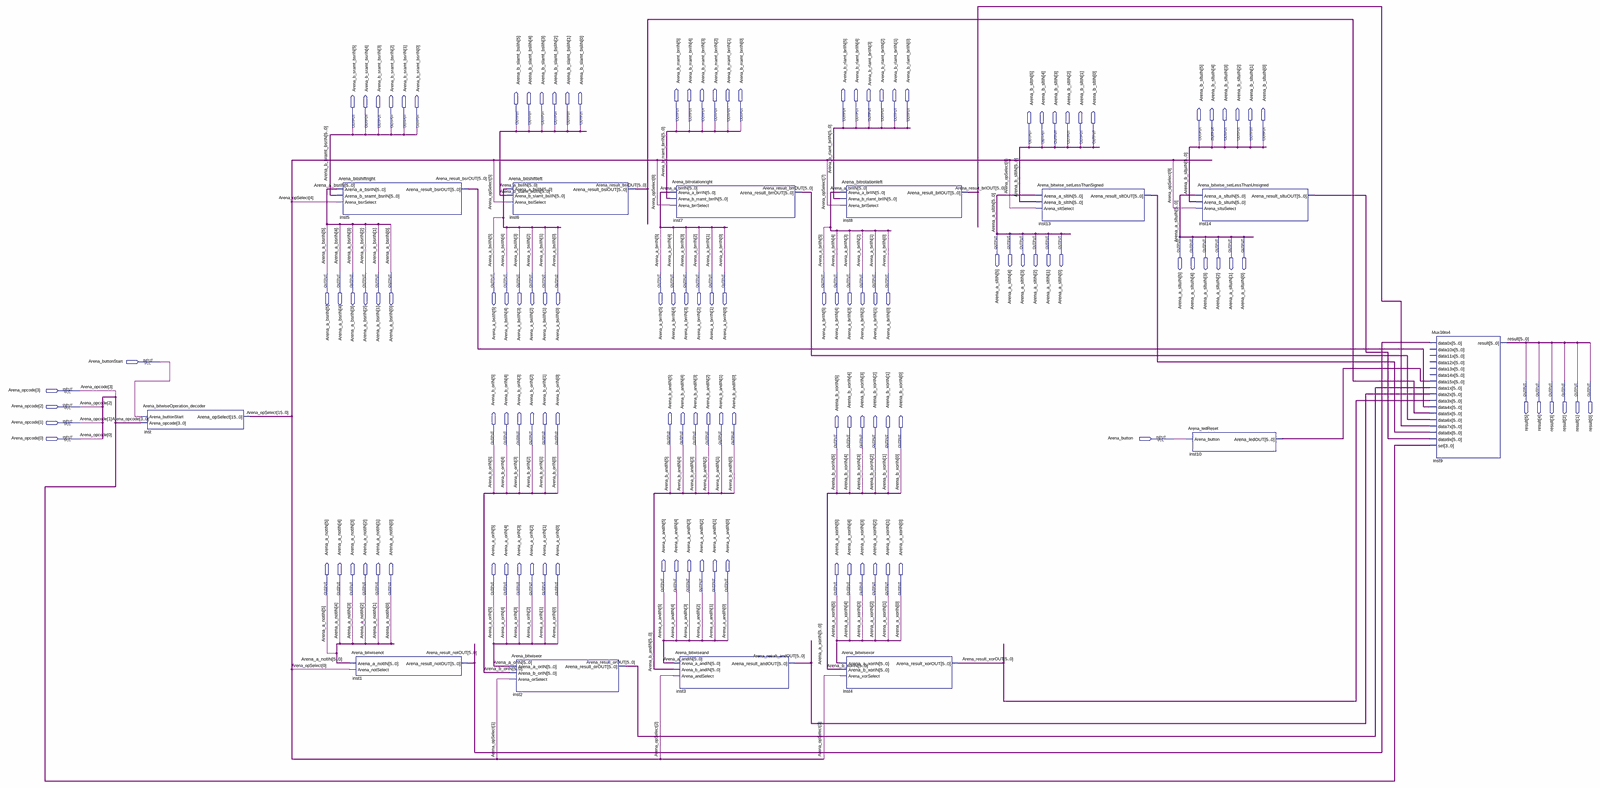
[diagram p0: schematic sheet, whole]
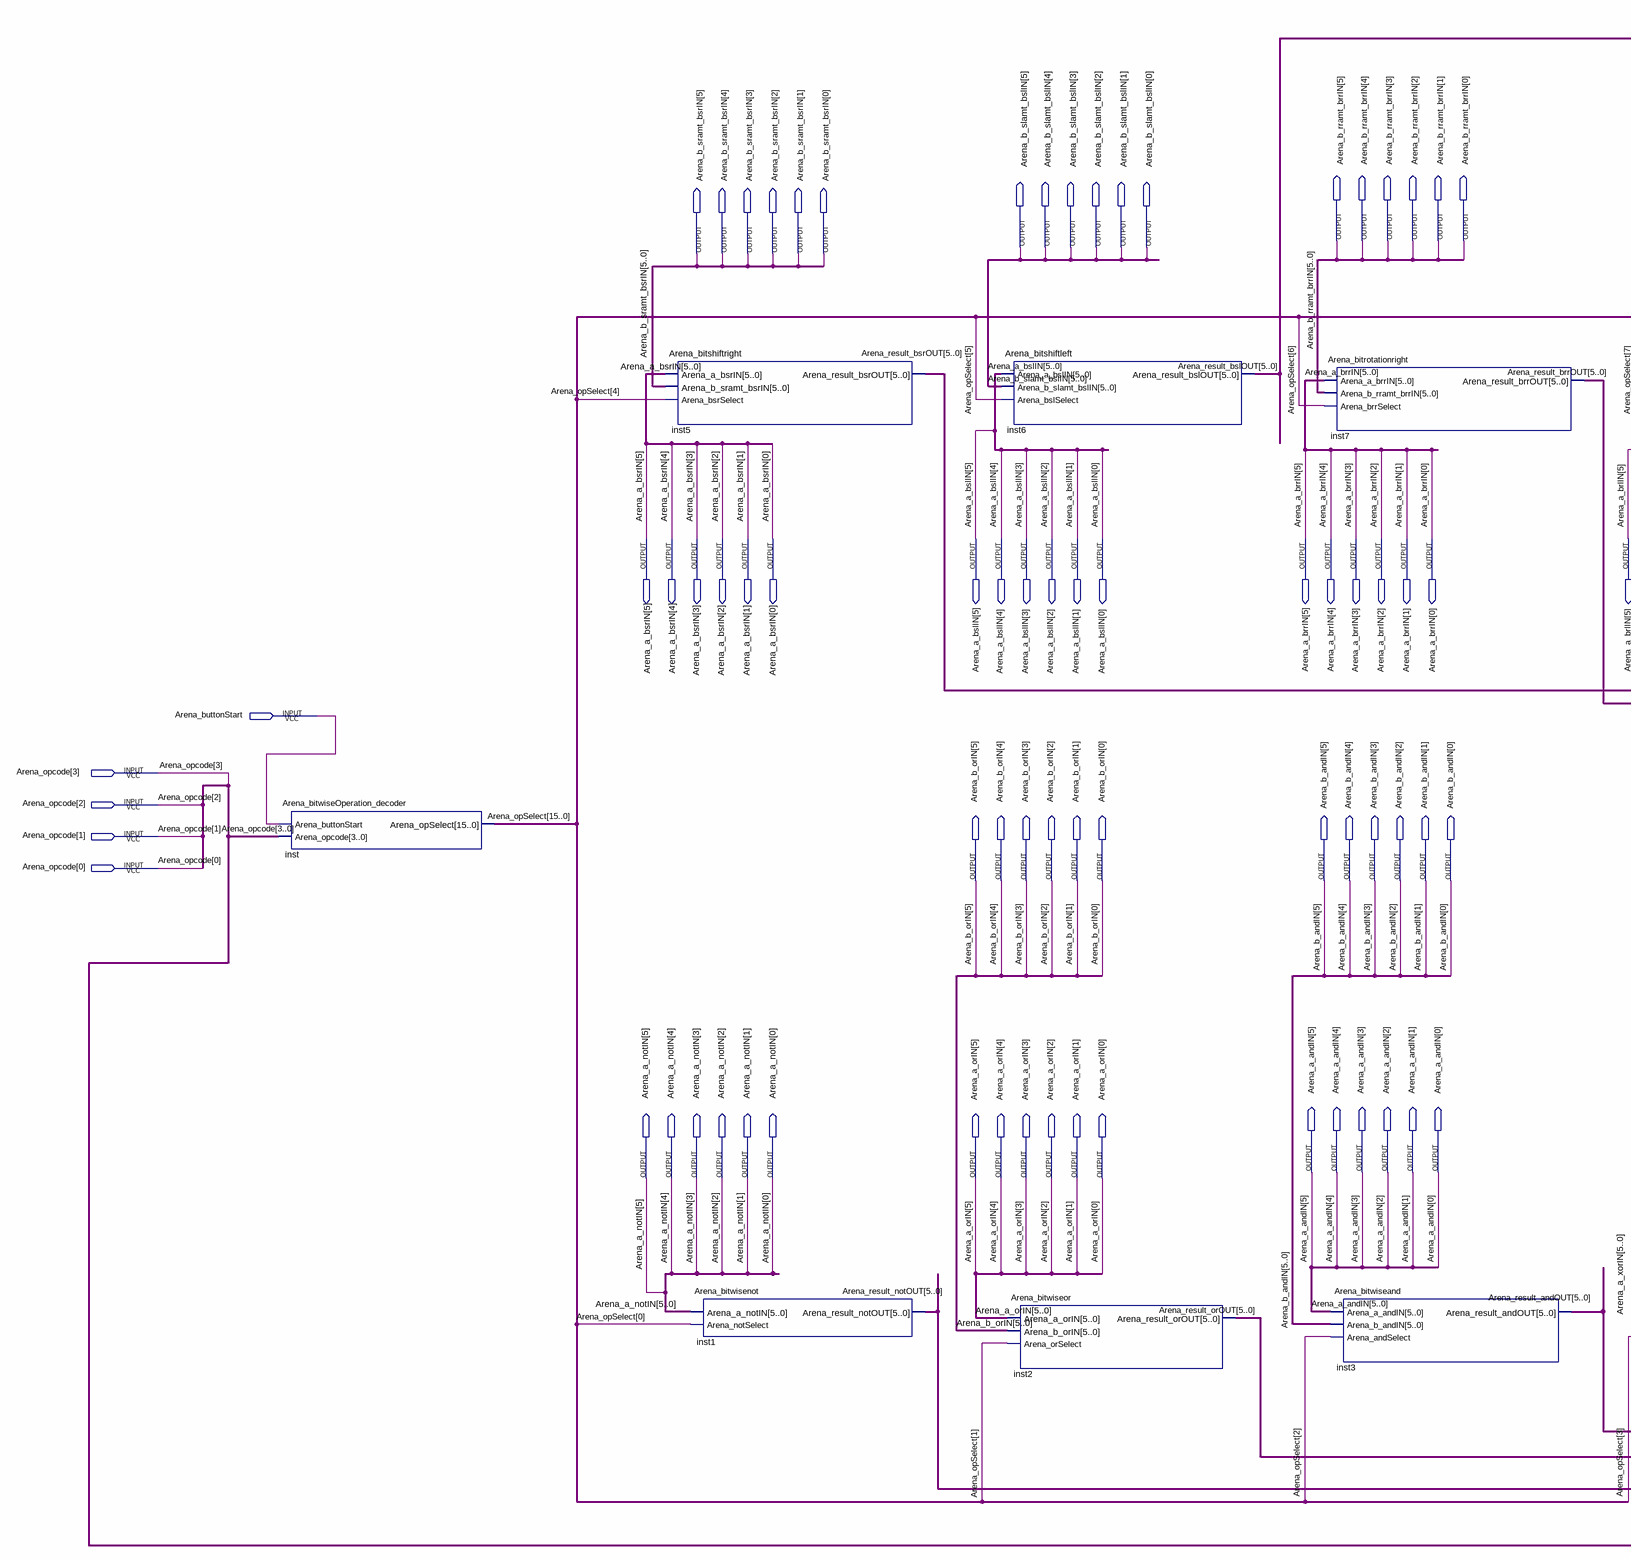
[diagram p1: schematic sheet, left part]
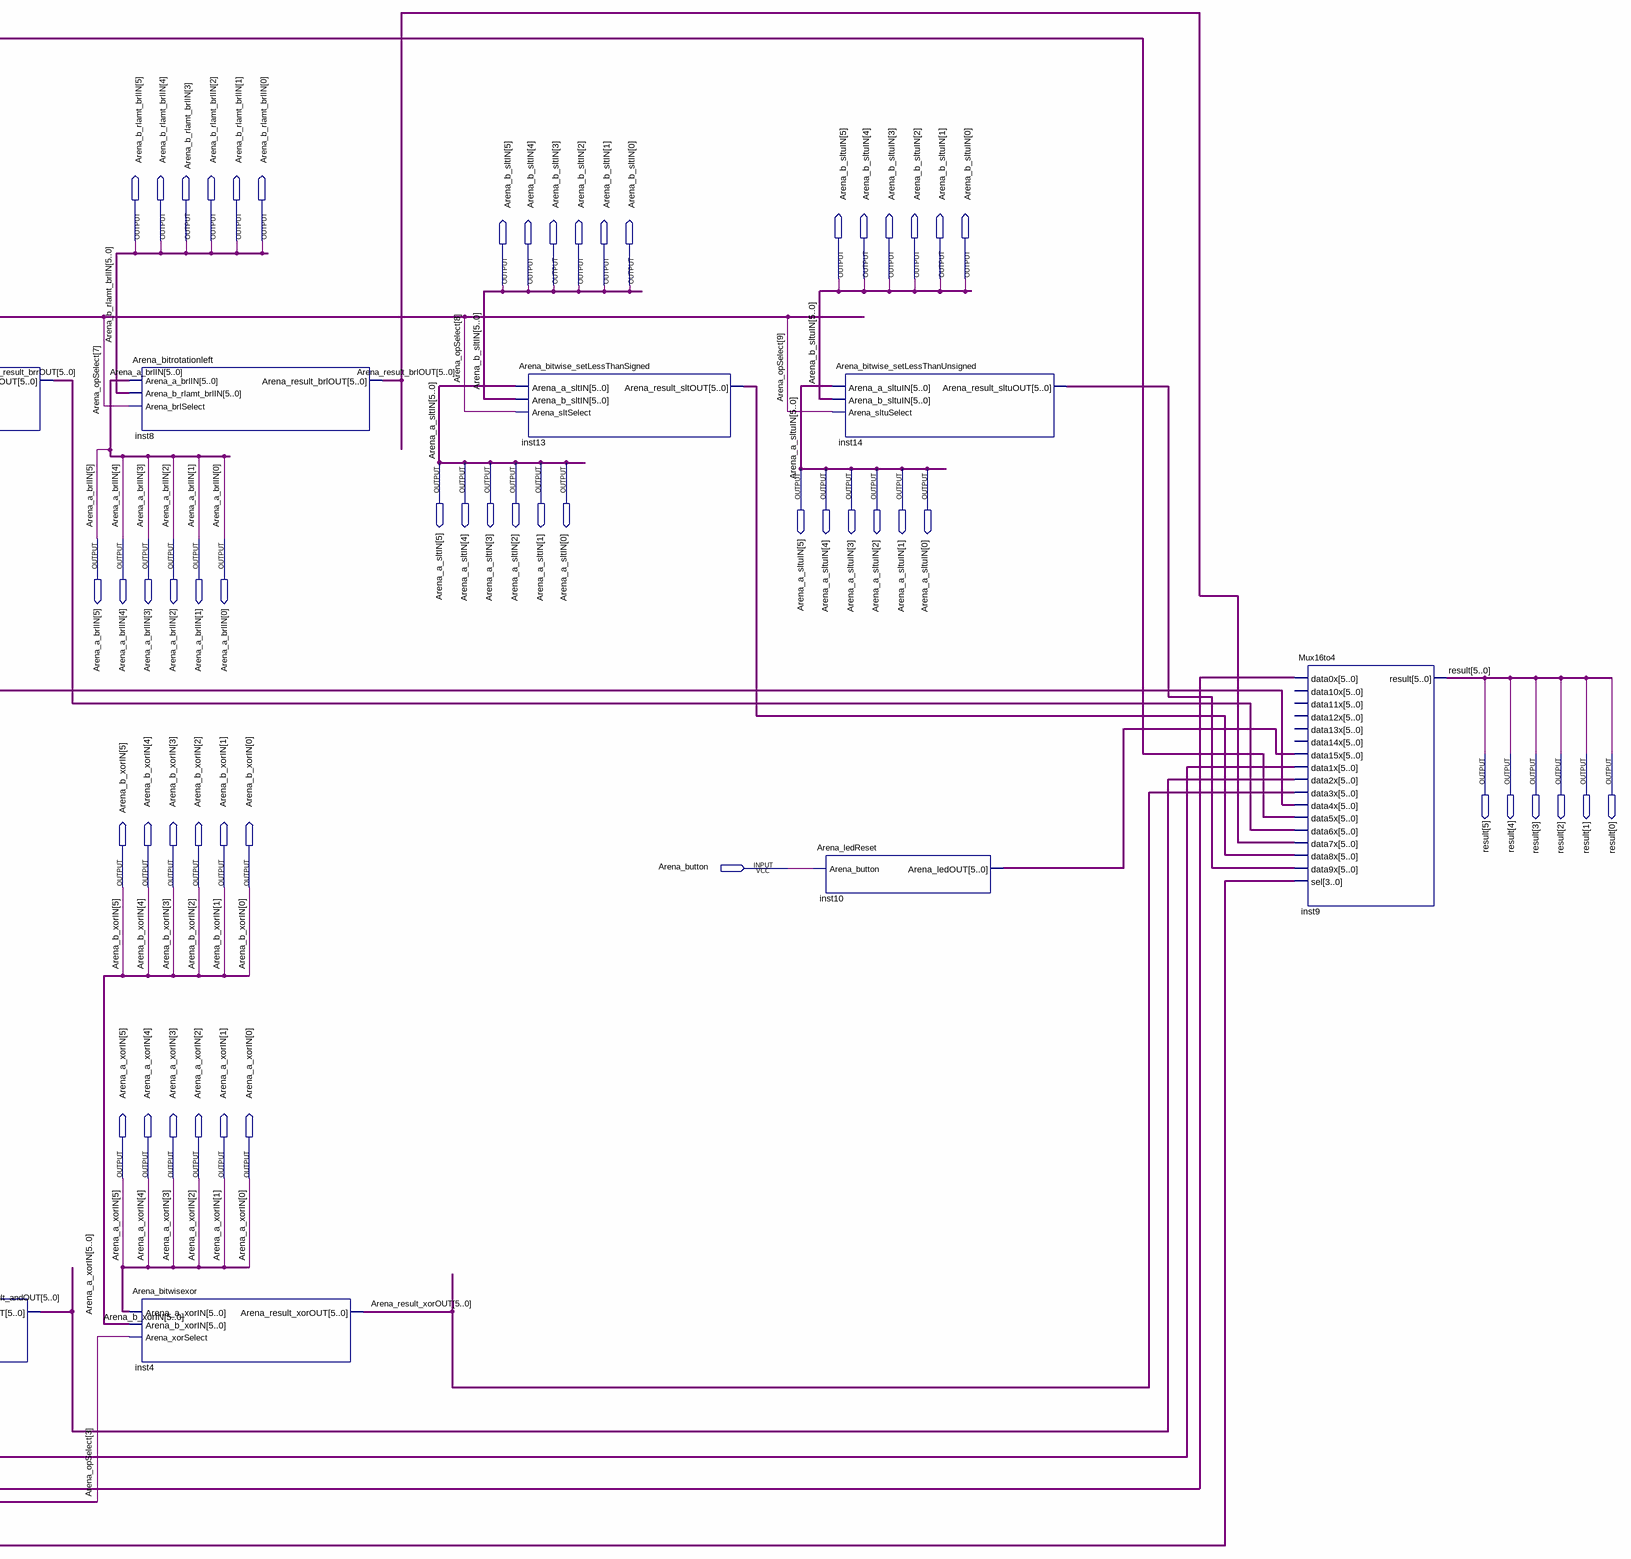
[diagram p2: schematic sheet, right part]
// Quartus schematic Arena_bitwise (2).bdf as structural Verilog: 13 symbols, 126 pins
module \Arena_bitwise_(2)  (
  input  Arena_buttonStart,
  input  [3:0] Arena_opcode,
  input  Arena_button,
  output [5:0] Arena_b_rramt_brrIN,
  output [5:0] Arena_b_rlamt_brlIN,
  output [5:0] Arena_b_slamt_bslIN,
  output [5:0] Arena_b_sramt_bsrIN,
  output [5:0] Arena_b_sltuIN,
  output [5:0] Arena_b_sltIN,
  output [5:0] Arena_a_sltIN,
  output [5:0] Arena_a_sltuIN,
  output [5:0] Arena_a_bsrIN,
  output [5:0] Arena_a_bslIN,
  output [5:0] Arena_a_brrIN,
  output [5:0] Arena_a_brlIN,
  output [5:0] result,
  output [5:0] Arena_b_orIN,
  output [5:0] Arena_b_andIN,
  output [5:0] Arena_b_xorIN,
  output [5:0] Arena_a_andIN,
  output [5:0] Arena_a_notIN,
  output [5:0] Arena_a_orIN,
  output [5:0] Arena_a_xorIN
);

  wire [5:0] Arena_result_andOUT, Arena_result_brlOUT, Arena_result_brrOUT, Arena_result_bslOUT,
       Arena_result_bsrOUT, Arena_result_notOUT, Arena_result_orOUT, Arena_result_xorOUT,
       inst10_arena_ledout, inst13_arena_result_sltout, inst14_arena_result_sltuout;
  wire [15:0] Arena_opSelect;

  Arena_bitwiseOperation_decoder inst (
    .Arena_buttonStart(Arena_buttonStart), .Arena_opcode(Arena_opcode), .Arena_opSelect(Arena_opSelect));
  Arena_bitshiftright inst5 (
    .Arena_a_bsrIN(Arena_a_bsrIN), .Arena_b_sramt_bsrIN(Arena_b_sramt_bsrIN),
    .Arena_bsrSelect(Arena_opSelect[4]), .Arena_result_bsrOUT(Arena_result_bsrOUT));
  Arena_bitwisenot inst1 (
    .Arena_a_notIN(Arena_a_notIN), .Arena_notSelect(Arena_opSelect[0]),
    .Arena_result_notOUT(Arena_result_notOUT));
  Arena_bitshiftleft inst6 (
    .Arena_a_bslIN(Arena_a_bslIN), .Arena_b_slamt_bslIN(Arena_b_slamt_bslIN),
    .Arena_bslSelect(Arena_opSelect[5]), .Arena_result_bslOUT(Arena_result_bslOUT));
  Arena_bitwiseor inst2 (
    .Arena_a_orIN(Arena_a_orIN), .Arena_b_orIN(Arena_b_orIN), .Arena_orSelect(Arena_opSelect[1]),
    .Arena_result_orOUT(Arena_result_orOUT));
  Arena_bitrotationright inst7 (
    .Arena_a_brrIN(Arena_a_brrIN), .Arena_b_rramt_brrIN(Arena_b_rramt_brrIN),
    .Arena_brrSelect(Arena_opSelect[6]), .Arena_result_brrOUT(Arena_result_brrOUT));
  Arena_bitwiseand inst3 (
    .Arena_a_andIN(Arena_a_andIN), .Arena_b_andIN(Arena_b_andIN), .Arena_andSelect(Arena_opSelect[2]),
    .Arena_result_andOUT(Arena_result_andOUT));
  Arena_bitrotationleft inst8 (
    .Arena_a_brlIN(Arena_a_brlIN), .Arena_b_rlamt_brlIN(Arena_b_rlamt_brlIN),
    .Arena_brlSelect(Arena_opSelect[7]), .Arena_result_brlOUT(Arena_result_brlOUT));
  Arena_bitwisexor inst4 (
    .Arena_a_xorIN(Arena_a_xorIN), .Arena_b_xorIN(Arena_b_xorIN), .Arena_xorSelect(Arena_opSelect[3]),
    .Arena_result_xorOUT(Arena_result_xorOUT));
  Arena_bitwise_setLessThanSigned inst13 (
    .Arena_a_sltIN(Arena_a_sltIN), .Arena_b_sltIN(Arena_b_sltIN), .Arena_sltSelect(Arena_opSelect[8]),
    .Arena_result_sltOUT(inst13_arena_result_sltout));
  Arena_bitwise_setLessThanUnsigned inst14 (
    .Arena_a_sltuIN(Arena_a_sltuIN), .Arena_b_sltuIN(Arena_b_sltuIN), .Arena_sltuSelect(Arena_opSelect[9]),
    .Arena_result_sltuOUT(inst14_arena_result_sltuout));
  Arena_ledReset inst10 (.Arena_button(Arena_button), .Arena_ledOUT(inst10_arena_ledout));
  Mux16to4 inst9 (
    .data0x(Arena_result_notOUT), .data15x(inst10_arena_ledout), .data1x(Arena_result_orOUT),
    .data2x(Arena_result_andOUT), .data3x(Arena_result_xorOUT), .data4x(Arena_result_bsrOUT),
    .data5x(Arena_result_bslOUT), .data6x(Arena_result_brrOUT), .data7x(Arena_result_brlOUT),
    .data8x(inst13_arena_result_sltout), .data9x(inst14_arena_result_sltuout), .sel(Arena_opcode),
    .result(result));  // open: data10x, data11x, data12x, data13x, data14x
endmodule
